# Altium schematic sheet channels_driver.SchDoc: 100R
size A4; Date: 100R; ApprovedBy: 100R; CheckedBy: 100R; Author: 100R; CompanyName: 100R; DrawnBy: 100R; Engineer: 100R; Organization: 100R; Address1: 100R; Address2: 100R; Address3: 100R; Address4: 100R; DocumentNumber: 100R; Revision: 100R; SheetNumber: 4; SheetTotal: 5; CurrentTime: 100R; CurrentDate: 100R; Time: 100R; DocumentFullPathAndName: 100R; DocumentName: 100R; ModifiedDate: 100R; Rule: 100R; ImagePath: 100R; ProjectName: 100R; Application_BuildNumber: 100R
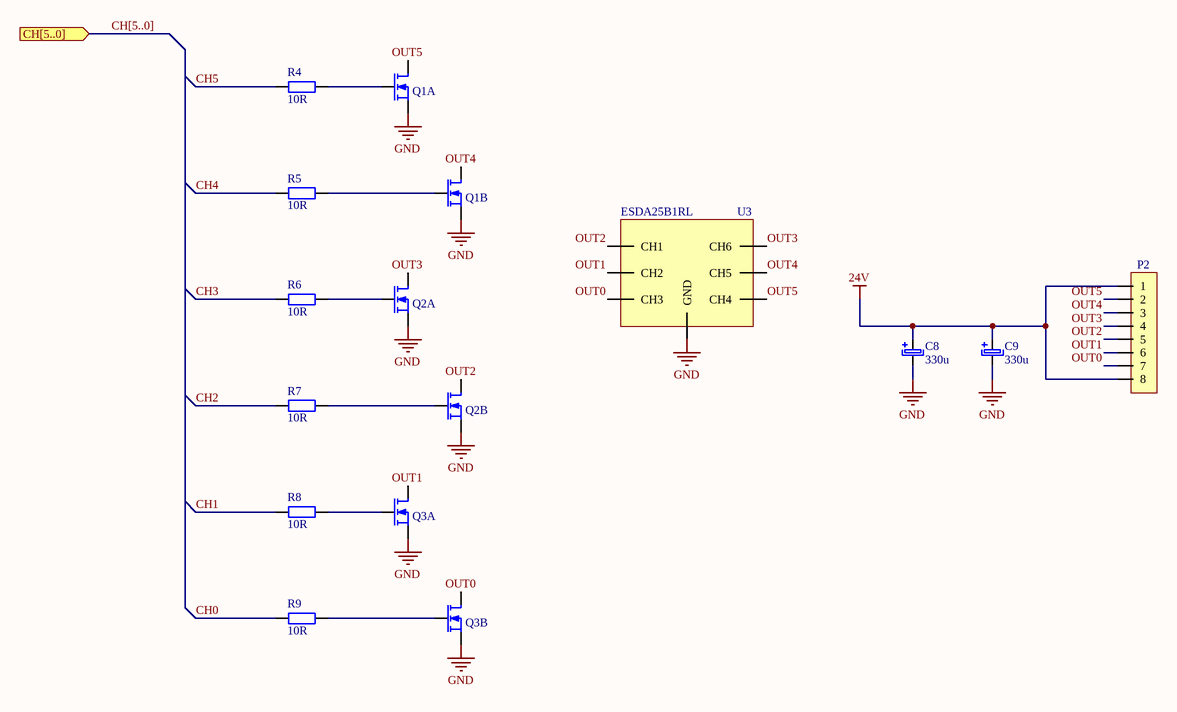
[diagram p0: channels_driver.SchDoc]

## Parts
C8  330u  [capacitor_tht_3mm5_lead_8mm]
C9  330u  [capacitor_tht_3mm5_lead_8mm]
P2  Terminal Block  [terminal_block_1X8_5mm08]  (value not drawn)
Q1  NMOS  [generic_SO-8]  (value not drawn)  (parts A,B of 2)
Q2  NMOS  [generic_SO-8]  (value not drawn)  (parts A,B of 2)
Q3  NMOS  [generic_SO-8]  (value not drawn)  (parts A,B of 2)
R4  10R  [resisitor_smd_0603]
R5  10R  [resisitor_smd_0603]
R6  10R  [resisitor_smd_0603]
R7  10R  [resisitor_smd_0603]
R8  10R  [resisitor_smd_0603]
R9  10R  [resisitor_smd_0603]
U3  ESDA25B1RL  [generic_SO-8]

## Ports
CH[5..0] (in, see LEDcontroller[3B], microcontroller[3C])

## Nets
24V: C8.1 C9.1 P2.1 P2.8
GND: C8.2 C9.2 Q1.2 Q1.5 Q2.2 Q2.5 Q3.2 Q3.5 U3.4,5(GND)
CH0: R9.1
CH1: R8.1
CH2: R7.1
CH3: R6.1
CH4: R5.1
CH5: R4.1
OUT0: P2.7 Q3.6 U3.3(CH3)
OUT1: P2.6 Q3.3 U3.2(CH2)
OUT2: P2.5 Q2.6 U3.1(CH1)
OUT3: P2.4 Q2.3 U3.8(CH6)
OUT4: P2.3 Q1.6 U3.7(CH5)
OUT5: P2.2 Q1.3 U3.6(CH4)
NetQ1_1: Q1.1 R4.2
NetQ1_4: Q1.4 R5.2
NetQ2_1: Q2.1 R6.2
NetQ2_4: Q2.4 R7.2
NetQ3_1: Q3.1 R8.2
NetQ3_4: Q3.4 R9.2

## Buses and harness runs
bus CH[5..0] = port CH[5..0]

## Library data of the parts
C8 C9 = Capacitor - polarised: Panasonic EEU-FS1V331LB
P2 = Terminal Block 1X8: 4x Adam Tech EBAFA-02-D
Q1-Q3 = Transistor - N-MOSFET 2 ch: ONSEMI FDS8949; pin to pad: 1>2 2>1 3>7+8 5>3 6>5+6
R4-R9 = Resistor: Vishay CRCW060310R0FKED
U3 = ESD diodes - 6 channels: STM ESDA25B1RL